# Altium schematic sheet boost_converter.SchDoc
size A4; SheetNumber: 2; SheetTotal: 5
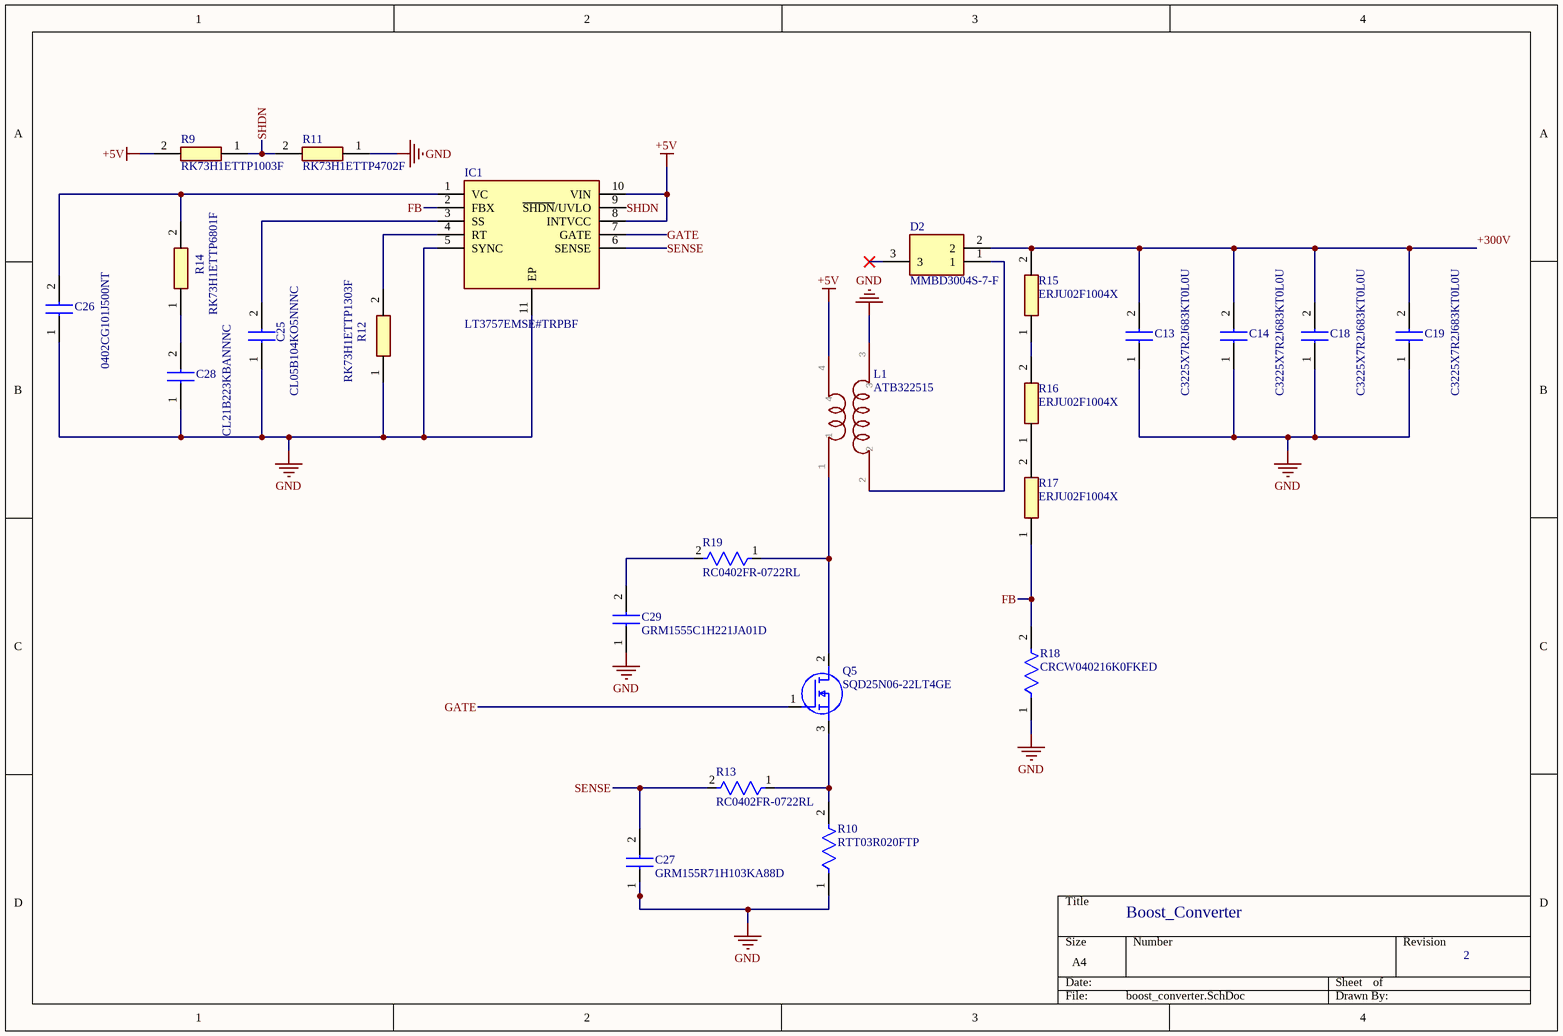
[diagram p0: boost_converter.SchDoc]

## Parts
C13  C3225X7R2J683KT0L0U  [CAPC3225X200N]
C14  C3225X7R2J683KT0L0U  [CAPC3225X200N]
C18  C3225X7R2J683KT0L0U  [CAPC3225X200N]
C19  C3225X7R2J683KT0L0U  [CAPC3225X200N]
C25  CL05B104KO5NNNC  [CAPC1005X55N]
C26  0402CG101J500NT  [CAPC1005X55N]
C27  GRM155R71H103KA88D  [GRM15x]
C28  CL21B223KBANNNC  [CAPC2012X75N]
C29  GRM1555C1H221JA01D  [CAPC1005X70N]
D2  MMBD3004S-7-F  [SOT96P240X100-3N]
IC1  LT3757EMSE#TRPBF  [SOP50P490X110-11N]
L1  ATB322515  [ATB322515]
Q5  SQD25N06-22LT4GE  [IPD25N06S4L30ATMA2]
R9  RK73H1ETTP1003F  [RESC1005X40N]
R10  RTT03R020FTP  [FP-PA0402-MFG]
R11  RK73H1ETTP4702F  [RESC1005X40N]
R12  RK73H1ETTP1303F  [RESC1005X40N]
R13  RC0402FR-0722RL  [FP-RC0402-0_4-MFG]
R14  RK73H1ETTP6801F  [RESC1005X40N]
R15  ERJU02F1004X  [ERJS02_U02_(0402)]
R16  ERJU02F1004X  [ERJS02_U02_(0402)]
R17  ERJU02F1004X  [ERJS02_U02_(0402)]
R18  CRCW040216K0FKED  [FP-CRCW0402-e3-IPC_C]
R19  RC0402FR-0722RL  [FP-RC0402-0_4-MFG]

## Nets
+5V: IC1.8(INTVCC) IC1.10(VIN) L1.4 R9.2
GND: C13.1 C14.1 C18.1 C19.1 C25.1 C26.1 C27.1 C28.1 C29.1 IC1.5(SYNC) IC1.11(EP) L1.3 R10.1 R11.1 R12.1 R18.1
+300V: C13.2 C14.2 C18.2 C19.2 D2.2 R15.2
FB: IC1.2(FBX) R17.1 R18.2
GATE: IC1.7(GATE) Q5.1(G)
SENSE: C27.2 IC1.6(SENSE) R13.2
SHDN: IC1.9(~{SHDN}/UVLO) R9.1 R11.2
NetC25_2: C25.2 IC1.3(SS)
NetC26_2: C26.2 IC1.1(VC) R14.2
NetC28_2: C28.2 R14.1
NetC29_2: C29.2 R19.2
NetD2_1: D2.1 L1.2
NetIC1_4: IC1.4(RT) R12.2
NetL1_1: L1.1 Q5.2(D) R19.1
NetQ5_3: Q5.3(S) R10.2 R13.1
NetR15_1: R15.1 R16.2
NetR16_1: R16.1 R17.2

Not connected (* = marked no-connect by the designer): D2 3*

## Notes on the sheet
- Boost_Converter
- 2

## Library data of the parts
C13 C14 C18 C19 = C3225X7R2J683K200AA: Capacitor; Manufacturer_Name: TDK; Datasheet Link: https://product.tdk.com/info/en/catalog/datasheets/mlcc_commercial_midvoltage_en.pdf; Height: 2mm; Manufacturer_Part_Number: C3225X7R2J683K200AA; Mouser Part Number: 810-C3225X7R2J683K; Mouser Price/Stock: https://www.mouser.com/Search/Refine.aspx?Keyword=810-C3225X7R2J683K; Arrow Part Number: C3225X7R2J683K200AA; Arrow Price/Stock: https://www.arrow.com/en/products/c3225x7r2j683k200aa/tdk?region=nac
C25 = CL05B104KO5NNNC: Capacitor; Manufacturer_Name: SAMSUNG; Datasheet Link: https://datasheet.datasheetarchive.com/originals/distributors/Datasheets-DGA10/2408147.pdf; Height: 0.55mm; Manufacturer_Part_Number: CL05B104KO5NNNC; Mouser Part Number: 187-CL05B104KO5NNNC; Mouser Price/Stock: https://www.mouser.co.uk/ProductDetail/Samsung-Electro-Mechanics/CL05B104KO5NNNC?qs=hqM3L16%252BxlfT2SKOuAUq6Q%3D%3D; Arrow Part Number: CL05B104KO5NNNC; Arrow Price/Stock: https://www.arrow.com/en/products/cl05b104ko5nnnc/samsung-electro-mechanics?utm_currency=USD&region=europe
C26 = 0402CG101J500NT: Capacitor; Manufacturer_Name: Guangdong Fenghua Advanced Tech; Datasheet Link: https://datasheet.lcsc.com/szlcsc/Guangdong-Fenghua-Advanced-Tech-0402CG101J500NT_C1546.pdf; Height: 0.55mm; Manufacturer_Part_Number: 0402CG101J500NT
C27 = GRM155R71H103KA88D: Capacitor; Manufacturer_Name: Murata Electronics; Datasheet Link: https://search.murata.co.jp/Ceramy/image/img/A01X/G101/ENG/GRM155R71H103KA88-01A.pdf; Height: 0.33mm; Manufacturer_Part_Number: GRM155R71H103KA88D; Mouser Part Number: 81-GRM155R71H103KA8D; Mouser Price/Stock: https://www.mouser.co.uk/ProductDetail/Murata-Electronics/GRM155R71H103KA88D?qs=Dfh4SrgScWxOVlCuzd3ZyQ%3D%3D; Arrow Part Number: GRM155R71H103KA88D; Arrow Price/Stock: https://www.arrow.com/en/products/grm155r71h103ka88d/murata-manufacturing?utm_currency=USD&region=nac
C28 = CL21B223KBANNNC: Capacitor; Manufacturer_Name: SAMSUNG; Datasheet Link: https://datasheet.datasheetarchive.com/originals/distributors/Datasheets_SAMA/f1186cf82a02fbe5c02a084f1b7bc7a5.pdf; Height: 0.75mm; Manufacturer_Part_Number: CL21B223KBANNNC; Mouser Part Number: 187-CL21B223KBANNNC; Mouser Price/Stock: https://www.mouser.co.uk/ProductDetail/Samsung-Electro-Mechanics/CL21B223KBANNNC?qs=349EhDEZ59o8NyW%2FjkRQDg%3D%3D; Arrow Part Number: CL21B223KBANNNC; Arrow Price/Stock: https://www.arrow.com/en/products/cl21b223kbannnc/samsung-electro-mechanics?utm_currency=USD&region=europe
C29 = GRM1555C1H221JA01D: Capacitor; Manufacturer_Name: Murata Electronics; Datasheet Link: https://search.murata.co.jp/Ceramy/image/img/A01X/G101/ENG/GRM1555C1H221JA01-01A.pdf; Height: 0.7mm; Manufacturer_Part_Number: GRM1555C1H221JA01D; Mouser Part Number: 81-GRM1555C1H221JA01; Mouser Price/Stock: https://www.mouser.co.uk/ProductDetail/Murata-Electronics/GRM1555C1H221JA01D?qs=AflYu6BMgmkFaPorbrBIOQ%3D%3D; Arrow Part Number: GRM1555C1H221JA01D; Arrow Price/Stock: https://www.arrow.com/en/products/grm1555c1h221ja01d/murata-manufacturing
D2 = MMBD3004S-7-F: Diode; Manufacturer_Name: Diodes Incorporated; Datasheet Link: http://www.farnell.com/datasheets/1911713.pdf; Height: 1mm; Manufacturer_Part_Number: MMBD3004S-7-F; Mouser Part Number: 621-MMBD3004S-F; Mouser Price/Stock: https://www.mouser.co.uk/ProductDetail/Diodes-Incorporated/MMBD3004S-7-F?qs=wlBvdarPgLYI%252BR4SoNTV%2Fg%3D%3D; Arrow Part Number: MMBD3004S-7-F; Arrow Price/Stock: https://www.arrow.com/en/products/mmbd3004s-7-f/diodes-incorporated
IC1 = LT3757EMSETRPBF: Integrated Circuit; Manufacturer_Name: Analog Devices; Height: 1.1mm; Manufacturer_Part_Number: LT3757EMSETRPBF
Q5 = IPD25N06S4L30ATMA2: 60V 25A 30mΩ@10V 2.5V 1PCSNChannel TO252-2L MOSFETs ROHS; Manufacturer_Name: Infineon; Manufacturer_Part_Number: 25N06; Datasheet Link: https://www.infineon.com/dgdl/Infineon-IPD25N06S4L-30-DS-v01_01-EN.pdf?fileId=db3a30431ff98815012038898f7b0caa; Height: 2.5mm; Mouser Part Number: IPD25N06S4L30ATMA2; Mouser Price/Stock: https://www.mouser.co.uk/ProductDetail/Infineon-Technologies/IPD25N06S4L30ATMA2?qs=OwbwYO03UsKv1XP00b%252BqYQ%3D%3D; Arrow Part Number: 25N06; Arrow Price/Stock: https://www.arrow.com/en/products/ipd25n06s4l30atma2/infineon-technologies-ag?region=nac
R9 = RK73H1ETTP1003F: Resistor; Manufacturer_Name: KOA Speer; Datasheet Link: http://www.koaspeer.com/catimages/Products/RK73-RT/RK73-RT.pdf; Height: 0.4mm; Manufacturer_Part_Number: RK73H1ETTP1003F; Mouser Part Number: 660-RK73H1ETTP1003F; Mouser Price/Stock: https://www.mouser.co.uk/ProductDetail/KOA-Speer/RK73H1ETTP1003F?qs=b1MjUb3%252BcaVl%2FZYcKgjmuQ%3D%3D; Arrow Part Number: RK73H1ETTP1003F; Arrow Price/Stock: https://www.arrow.com/en/products/rk73h1ettp1003f/koa-speer-electronics?region=nac
R10 = CMP-03412-023933-1: METAL CURRENT SENSOR 0402 1% 150; Manufacturer: Yageo; Value: 20mΩ; Temperature Coefficient: 150ppm/°C; Power Rating: 0.167W; Series: PA0402; Category: Res; RoHS: TRUE; Ipc Land Pattern Name: RESC10055X40; Composition: Metal Element; Manufacturer Part Number: RTT03R020FTP; Temperature Range High: +125°C; Device Class L1: Passive Components; Package: PA0402; Height: 0.4mm; Temperature: -55°C to +125°C; Device Class L3: Chip SMD Resistors; Tolerance: 1%; Automotive: No; Lead Free: Yes; Digikey Description: METAL CURRENT SENSOR 0402 1% 150; Octopart: https://octopart.com/pa0402frl7t0r02l-yageo-86729964; Resistance: 20mΩ; Temperature Range Low: -55°C; ComponentLink2URL: http://www.yageo.com/documents/recent/PYu-PA0402_L_51_RoHS_0.pdf; Device Class L2: Resistors; ComponentLink2Description: Datasheet
R11 = RK73H1ETTP4702F: Resistor; Manufacturer_Name: KOA Speer; Datasheet Link: http://www.koaspeer.com/catimages/Products/RK73-RT/RK73-RT.pdf; Height: 0.4mm; Manufacturer_Part_Number: RK73H1ETTP4702F; Mouser Part Number: 660-RK73H1ETTP4702F; Mouser Price/Stock: https://www.mouser.co.uk/ProductDetail/KOA-Speer/RK73H1ETTP4702F?qs=VhCg8p3QXBbdph5DclKeLw%3D%3D; Arrow Part Number: RK73H1ETTP4702F; Arrow Price/Stock: https://www.arrow.com/en/products/rk73h1ettp4702f/koa-speer-electronics
R12 = RK73H1ETTP1303F: Resistor; Manufacturer_Name: KOA Speer; Datasheet Link: http://www.koaspeer.com/catimages/Products/RK73-RT/RK73-RT.pdf; Height: 0.4mm; Manufacturer_Part_Number: RK73H1ETTP1303F; Mouser Part Number: 660-RK73H1ETTP1303F; Mouser Price/Stock: https://www.mouser.co.uk/ProductDetail/KOA-Speer/RK73H1ETTP1303F?qs=nWTjSGqwIiQKngPNRzbM%2FA%3D%3D
R13 R19 = CMP-2002-07520-2: Tolerance: 1%; Power Rating: 63mW; Voltage Rating: 50V; Temperature Coefficient: 100ppm/°C; Resistance: 22Ω; Termination: SMD/SMT; Depth: 500µm; Packaging: Tape & Reel; Height: 400µm; Width: 500µm; Case Code (Imperial): 0402; Length: 1mm; Schedule B: 8533210045, 8533210045; Case/Package: 0402; Max Operating Temperature: 155°C; Min Operating Temperature: -55°C; REACH SVHC: Unknown; RoHS: Compliant; Military Standard: Not; Voltage Rating (DC): 50V; Lead Free: Lead Free; Voltage Rating (AC): 50V; Number of Pins: 2; Composition: Thick Film
R14 = RK73H1ETTP6801F: Resistor; Manufacturer_Name: KOA Speer; Datasheet Link: http://www.koaspeer.com/catimages/Products/RK73-RT/RK73-RT.pdf; Height: 0.4mm; Manufacturer_Part_Number: RK73H1ETTP6801F; Mouser Part Number: 660-RK73H1ETTP6801F; Mouser Price/Stock: https://www.mouser.com/Search/Refine.aspx?Keyword=660-RK73H1ETTP6801F; Arrow Part Number: RK73H1ETTP6801F; Arrow Price/Stock: https://www.arrow.com/en/products/rk73h1ettp6801f/koa-speer-electronics
R15-R17 = ERJU02F1004X: Resistor; Manufacturer_Name: Panasonic; Datasheet Link: https://industrial.panasonic.com/cdbs/www-data/pdf/RDP0000/AOA0000C334.pdf; Height: 0.4mm; Manufacturer_Part_Number: ERJU02F1004X
R18 = CMP-1011-00644-3: RES Thick Film, 16kΩ, 1%, 0.063W, 100ppm/°C, 0402; Voltage Rating: 50V; Max Power Dissipation: 63mW; Resistance: 16kR; Military Standard: Not; Contact Plating: Tin; Mount: Surface Mount; Termination: SMD/SMT; Length: 1mm; Composition: Thick Film; Package Quantity: 10; Case Code (Imperial): 0402; Min Operating Temperature: -55°C; Depth: 0.5mm; Case/Package: 0402; Power Rating: 63mW; Radiation Hardening: No; Lead Free: Lead Free; Voltage Rating (DC): 50V; Packaging: Tape and Reel; Height: 0.35mm; Max Operating Temperature: 155°C; Width: 0.02inch; Number of Terminations: 2; Tolerance: 1%; Weight: 2.3E-05oz; Temperature Coefficient: 100ppm/°C; Number of Pins: 2; Features: Automotive AEC-Q200; Case Code (Metric): 1005